# EAGLE design T01_post_final_386_revise (EAGLE 7.1.0)
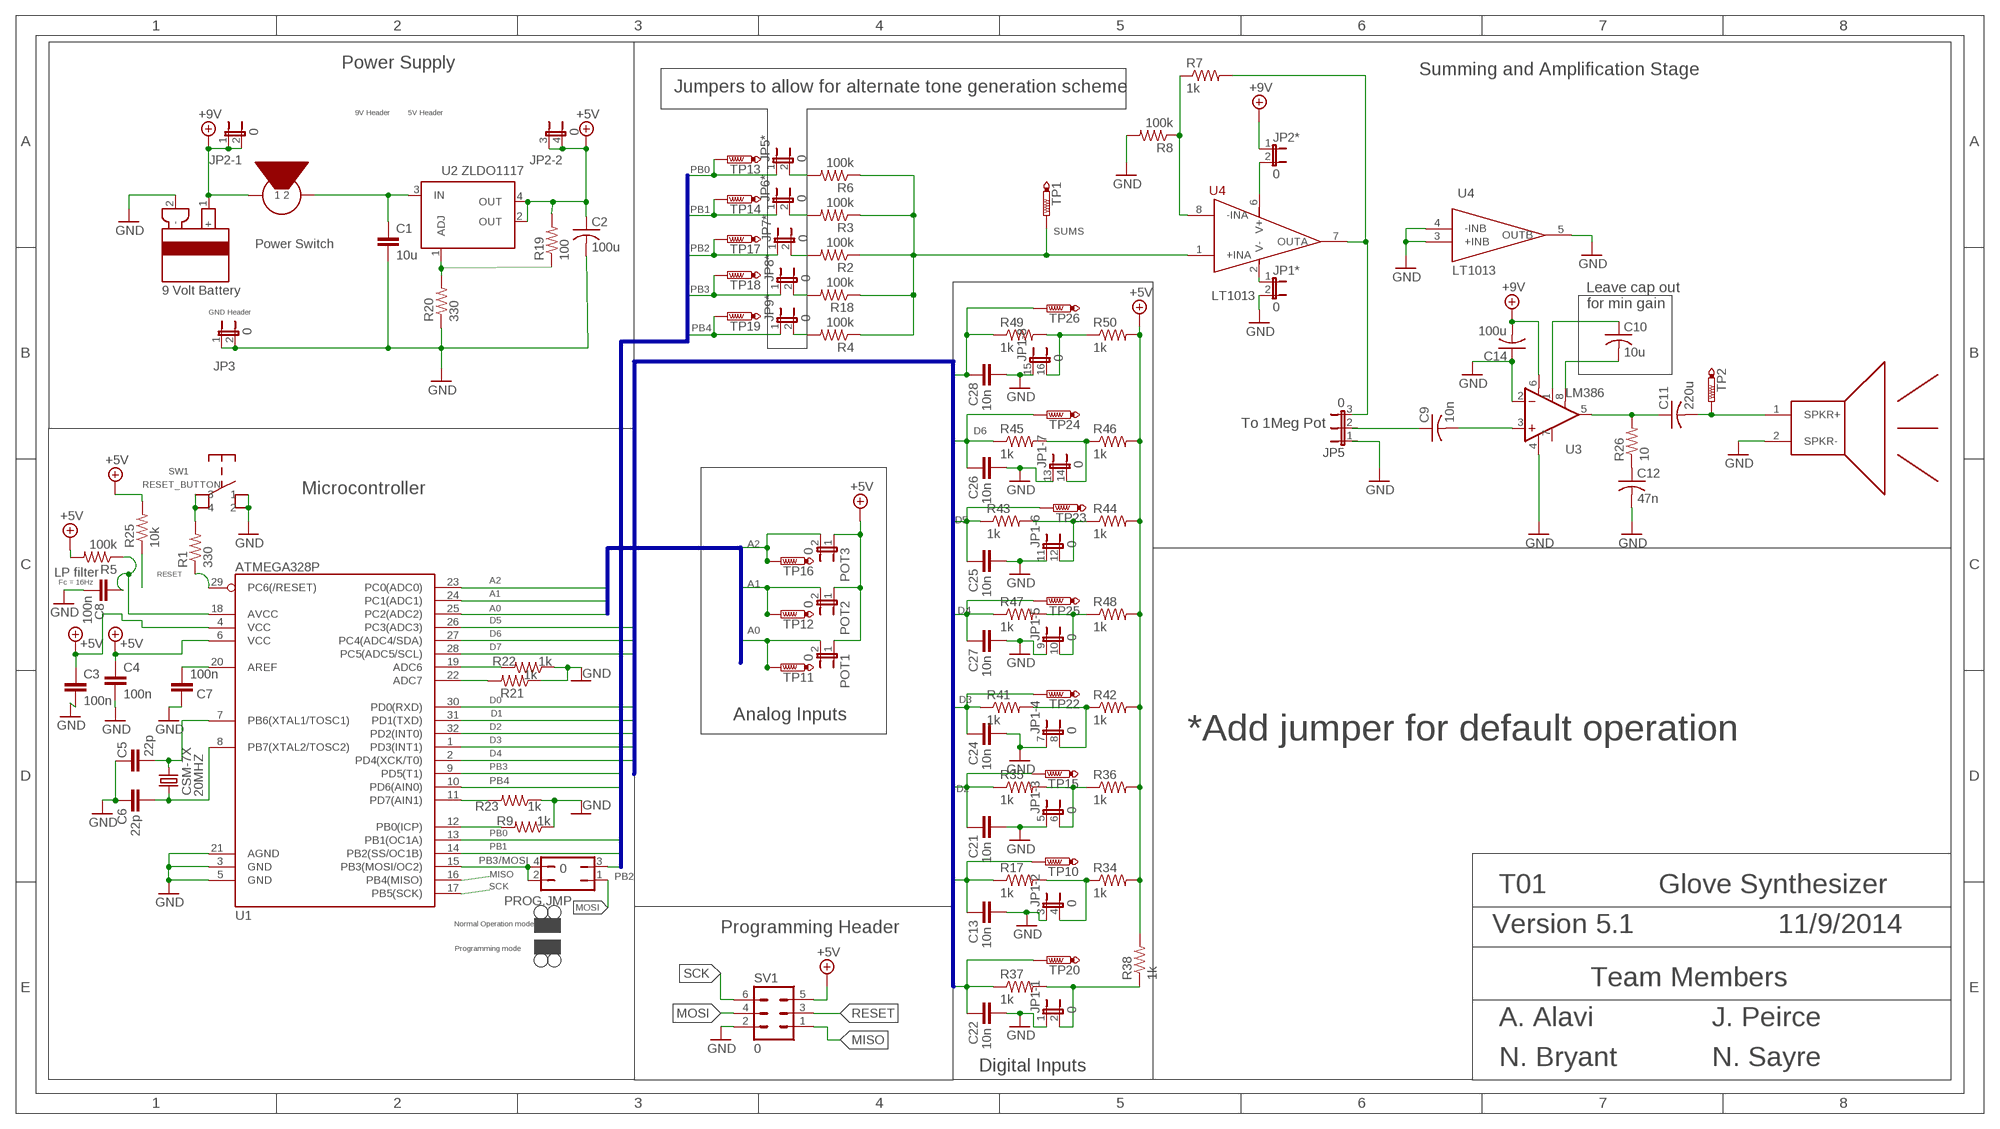
[diagram p0: schematic, sheet 1]

## Parts
20MHZ  CSM-7X  CSM-7X-DU  [CSM-7X-DU]
C1  10u  CAP0603-CAP  [0603-CAP]
C2  100u  C-US075-042X103  [C075-042X103]
C3  100n  CAP0603-CAP  [0603-CAP]
C4  100n  CAP0603-CAP  [0603-CAP]
C5  22p  CAP0603-CAP  [0603-CAP]
C6  22p  CAP0603-CAP  [0603-CAP]
C7  100n  CAP0603-CAP  [0603-CAP]
C8  100n  CAP0603-CAP  [0603-CAP]
C9  10n  C-US025-030X050  [C025-030X050]
C10  10u  C-US025-030X050  [C025-030X050]
C11  220u  C-US025-030X050  [C025-030X050]
C12  47n  C-US025-030X050  [C025-030X050]
C13  10n  CAP0603-CAP  [0603-CAP]
C14  100u  C-US025-030X050  [C025-030X050]
C21  10n  CAP0603-CAP  [0603-CAP]
C22  10n  CAP0603-CAP  [0603-CAP]
C24  10n  CAP0603-CAP  [0603-CAP]
C25  10n  CAP0603-CAP  [0603-CAP]
C26  10n  CAP0603-CAP  [0603-CAP]
C27  10n  CAP0603-CAP  [0603-CAP]
C28  10n  CAP0603-CAP  [0603-CAP]
JP1  0  JP8QE  [JP8Q]
JP1*  0  JP1E  [JP1]
JP2  0  JP2QE  [JP2Q]
JP2*  0  JP1E  [JP1]
JP3  0  JP1E  [JP1]
JP5  0  JP2E  [JP2]
JP5*  0  JP1E  [JP1]
JP6*  0  JP1E  [JP1]
JP7*  0  JP1E  [JP1]
JP8*  0  JP1E  [JP1]
JP9*  0  JP1E  [JP1]
POT1  0  JP1E  [JP1]
POT2  0  JP1E  [JP1]
POT3  0  JP1E  [JP1]
PROG.JMP  0  JP2Q  [JP2Q]
R1  330  RESISTOR0603  [0603-RES]
R2  100k  RESISTOR0603  [0603-RES]
R3  100k  RESISTOR0603  [0603-RES]
R4  100k  RESISTOR0603  [0603-RES]
R5  100k  RESISTOR0603  [0603-RES]
R6  100k  RESISTOR0603  [0603-RES]
R7  1k  RESISTOR0603  [0603-RES]
R8  100k  RESISTOR0603  [0603-RES]
R9  1k  RESISTOR0603  [0603-RES]
R17  1k  RESISTOR0603  [0603-RES]
R18  100k  RESISTOR0603  [0603-RES]
R19  100  RESISTOR0603  [0603-RES]
R20  330  RESISTOR0603  [0603-RES]
R21  1k  RESISTOR0603  [0603-RES]
R22  1k  RESISTOR0603  [0603-RES]
R23  1k  RESISTOR0603  [0603-RES]
R25  10k  RESISTOR0603  [0603-RES]
R26  10  R-US_0204/2V  [0204V]
R34  1k  RESISTOR0603  [0603-RES]
R35  1k  RESISTOR0603  [0603-RES]
R36  1k  RESISTOR0603  [0603-RES]
R37  1k  RESISTOR0603  [0603-RES]
R38  1k  RESISTOR0603  [0603-RES]
R41  1k  RESISTOR0603  [0603-RES]
R42  1k  RESISTOR0603  [0603-RES]
R43  1k  RESISTOR0603  [0603-RES]
R44  1k  RESISTOR0603  [0603-RES]
R45  1k  RESISTOR0603  [0603-RES]
R46  1k  RESISTOR0603  [0603-RES]
R47  1k  RESISTOR0603  [0603-RES]
R48  1k  RESISTOR0603  [0603-RES]
R49  1k  RESISTOR0603  [0603-RES]
R50  1k  RESISTOR0603  [0603-RES]
SV1  0  MA03-2  [MA03-2]
SW1  RESET_BUTTON  [RESET_BUTTON]
TP1  PTR1B2,54  [B2,54]
TP2  PTR1B2,54  [B2,54]
TP10  PTR1B2,54  [B2,54]
TP11  PTR1B2,54  [B2,54]
TP12  PTR1B2,54  [B2,54]
TP13  PTR1B2,54  [B2,54]
TP14  PTR1B2,54  [B2,54]
TP15  PTR1B2,54  [B2,54]
TP16  PTR1B2,54  [B2,54]
TP17  PTR1B2,54  [B2,54]
TP18  PTR1B2,54  [B2,54]
TP19  PTR1B2,54  [B2,54]
TP20  PTR1B2,54  [B2,54]
TP22  PTR1B2,54  [B2,54]
TP23  PTR1B2,54  [B2,54]
TP24  PTR1B2,54  [B2,54]
TP25  PTR1B2,54  [B2,54]
TP26  PTR1B2,54  [B2,54]
U1  ATMEGA328P  ATMEGA328_SMT  [TQFP32-08]
U2  ZLDO1117  [SOT223]
U3  LM386  [DIP08]
U4  LT1013  [SO08]
U$1  SPEAKER  [JP1]
U$7  POWER_SWITCH  [JP1]
U$8  9VOLTBATTERY  [JP1]

## Nets
+5V: C2.1 C3.1 C4.1 JP2.3 JP2.4 POT1.1 POT2.1 POT3.1 R5.2 R19.2 R25.2 R34.2 R36.2 R38.2 R42.2 R44.2 R46.2 R48.2 R50.2 SV1.5 U1.4(VCC) U1.6(VCC) U2.2(OUT) U2.4(OUT)
+9V: C14.2 JP2*.1 JP2.1 JP2.2 U3.6(V+) U$7.1 U$8.1(+)
A0: POT1.2 TP11.TP U1.25(PC2(ADC2))
A1: POT2.2 TP12.TP U1.24(PC1(ADC1))
A2: POT3.2 TP16.TP U1.23(PC0(ADC0))
D0: C22.2 R37.1 TP20.TP U1.30(PD0(RXD))
D1: C13.2 R17.1 TP10.TP U1.31(PD1(TXD))
D2: C21.2 R35.1 TP15.TP U1.32(PD2(INT0))
D3: C24.2 R41.1 TP22.TP U1.1(PD3(INT1))
D4: C27.2 R47.1 TP25.TP U1.2(PD4(XCK/T0))
D5: C25.2 R43.1 TP23.TP U1.26(PC3(ADC3))
D6: C26.2 R45.1 TP24.TP U1.27(PC4(ADC4/SDA))
D7: C28.2 R49.1 TP26.TP U1.28(PC5(ADC5/SCL))
GND: C1.2 C2.2 C3.2 C4.2 C5.2 C6.2 C7.2 C8.2 C12.2 C13.1 C14.1 C21.1 C22.1 C24.1 C25.1 C26.1 C27.1 C28.1 JP1*.2 JP1.1 JP1.3 JP1.5 JP1.7 JP1.9 JP1.11 JP1.13 JP1.15 JP3.1 JP3.2 R8.2 R9.1 R20.1 R21.1 R22.1 R23.1 SV1.2 SW1.1 SW1.2 U1.3(GND) U1.5(GND) U1.21(AGND) U3.2(-IN) U3.4(V-) U4.3(+INB) U4.4(-INB) U4.5(OUTB) U$1.2(SPKR-) U$8.2(-)
MISO: SV1.1 U1.16(PB4(MISO))
MOSI: PROG.JMP.1 SV1.4
N$1: C7.1 U1.20(AREF)
N$2: JP1.8 R41.2 R42.1
N$3: JP1.12 R43.2 R44.1
N$4: R1.1 U1.29(PC6(/RESET))
N$5: R7.2 U4.7(OUTA)
N$6: 20MHZ.1 C5.1 U1.7(PB6(XTAL1/TOSC1))
N$7: 20MHZ.2 C6.1 U1.8(PB7(XTAL2/TOSC2))
N$8: C8.1 R5.1 U1.18(AVCC)
N$9: R21.2 U1.22(ADC7)
N$10: R22.2 U1.19(ADC6)
N$11: C9.1
N$12: C9.2 U3.3(+IN)
N$13: JP1.6 R35.2 R36.1
N$16: R7.1 R8.1 U4.8(-INA)
N$17: R9.2 U1.12(PB0(ICP))
N$18: JP5*.2 R6.2
N$21: JP9*.2 R4.2
N$22: R1.2 SW1.3 SW1.4
N$23: JP1.4 R17.2 R34.1
N$25: JP8*.2 R18.2
N$27: C10.1 U3.1(GAIN)
N$31: C11.2 TP2.TP U$1.1(SPKR+)
N$32: JP7*.2 R2.2
N$34: JP2*.2 U4.6(V+)
N$37: R19.1 R20.2 U2.1(ADJ)
N$38: C1.1 U2.3(IN) U$7.2
N$39: JP6*.2 R3.2
N$41: C10.2 U3.8(GAIN)
N$43: JP1.2 R37.2 R38.1
N$49: C11.1 R26.2 U3.5(OUT)
N$50: C12.1 R26.1
N$51: JP1.14 R45.2 R46.1
N$52: JP1.10 R47.2 R48.1
N$53: JP1.16 R49.2 R50.1
PB0: JP5*.1 TP13.TP U1.13(PB1(OC1A))
PB1: JP6*.1 TP14.TP U1.14(PB2(SS/OC1B))
PB2: JP7*.1 PROG.JMP.3 TP17.TP
PB3: JP8*.1 TP18.TP U1.9(PD5(T1))
PB3/MOSI: PROG.JMP.2 PROG.JMP.4 U1.15(PB3(MOSI/OC2))
PB4: JP9*.1 TP19.TP U1.10(PD6(AIN0))
PD7: R23.2 U1.11(PD7(AIN1))
RESET: R25.1 SV1.3
SCK: SV1.6 U1.17(PB5(SCK))
SUMS: R2.1 R3.1 R4.1 R6.1 R18.1 TP1.TP U4.1(+INA)
V-: JP1*.1 U4.2(V-)
Unconnected: JP5.1 JP5.2 JP5.3 U3.7(BP)

## Buses
D[0..7]
PB[0..4]
A[0..2]

## Notes on the sheet
- Power Supply
- Summing and Amplification Stage
- Jumpers to allow for alternate tone generation scheme
- 9V Header | 5V Header
- Power Switch
- Leave cap out
  for min gain
- GND Header
- To 1Meg Pot
- Microcontroller
- LP filter
- Fc = 16Hz
- Analog Inputs
- *Add jumper for default operation
- T01 | Glove Synthesizer
- Normal Operation mode
- Programming Header | Version 5.1 | 11/9/2014
- Programming mode
- Team Members
- A. Alavi | J. Peirce
- Digital Inputs
- N. Bryant | N. Sayre

## Library data of the parts
20MHZ = crystal:CSM-7X-DU: SMD CRYSTAL Source: www.ecsxtal.com .. Crystal 3.6864MHz CSM_7X_DU.PDF; OC_FARNELL: unknown; OC_NEWARK: unknown
C1 C3-C8 C13 C21 C22 C24-C28 = SparkFun-Capacitors:CAP: Capacitor Standard 0603 ceramic capacitor, and 0.1" leaded capacitor.
C2 C9-C12 C14 = adafruit:C-US: CAPACITOR, American symbol
JP1 = jumper:JP8QE: JUMPER
JP1* JP2* JP3 JP5* JP6* JP7* JP8* JP9* POT1-POT3 = jumper:JP1E: JUMPER
JP2 = jumper:JP2QE: JUMPER
JP5 = jumper:JP2E: JUMPER
PROG.JMP = jumper:JP2Q: JUMPER
R1-R9 R17-R23 R25 R34-R38 R41-R50 = SparkFun-Resistors:RESISTOR: Resistor Basic schematic elements and footprints for 0603, 1206, and PTH resistors.
R26 = adafruit:R-US_: RESISTOR, American symbol
SV1 = con-lstb:MA03-2: PIN HEADER; OC_FARNELL: unknown; OC_NEWARK: unknown
SW1 = Synth_Glove:RESET_BUTTON
TP1 TP2 TP10-TP20 TP22-TP26 = testpad:PTR1: TEST PIN
U1 = SparkFun-DigitalIC:ATMEGA328_SMT: 32-Pin Atmega328 part Commonly used on Arduino compatible boards Available in QFP and QFN packages TQFP is IC-09069 QFN is non-stock; PROD_ID: IC-09069
U2 = Synth_Glove:ZLDO1117
U3 = SparkFun-AnalogIC:LM386: low voltage audio power amplifier
U4 = Synth_Glove:LT1013: Linear Technology dual input precision op amps
U$1 = Synth_Glove:SPEAKER
U$7 = Synth_Glove:POWER_SWITCH
U$8 = Synth_Glove:9VOLTBATTERY

## Board
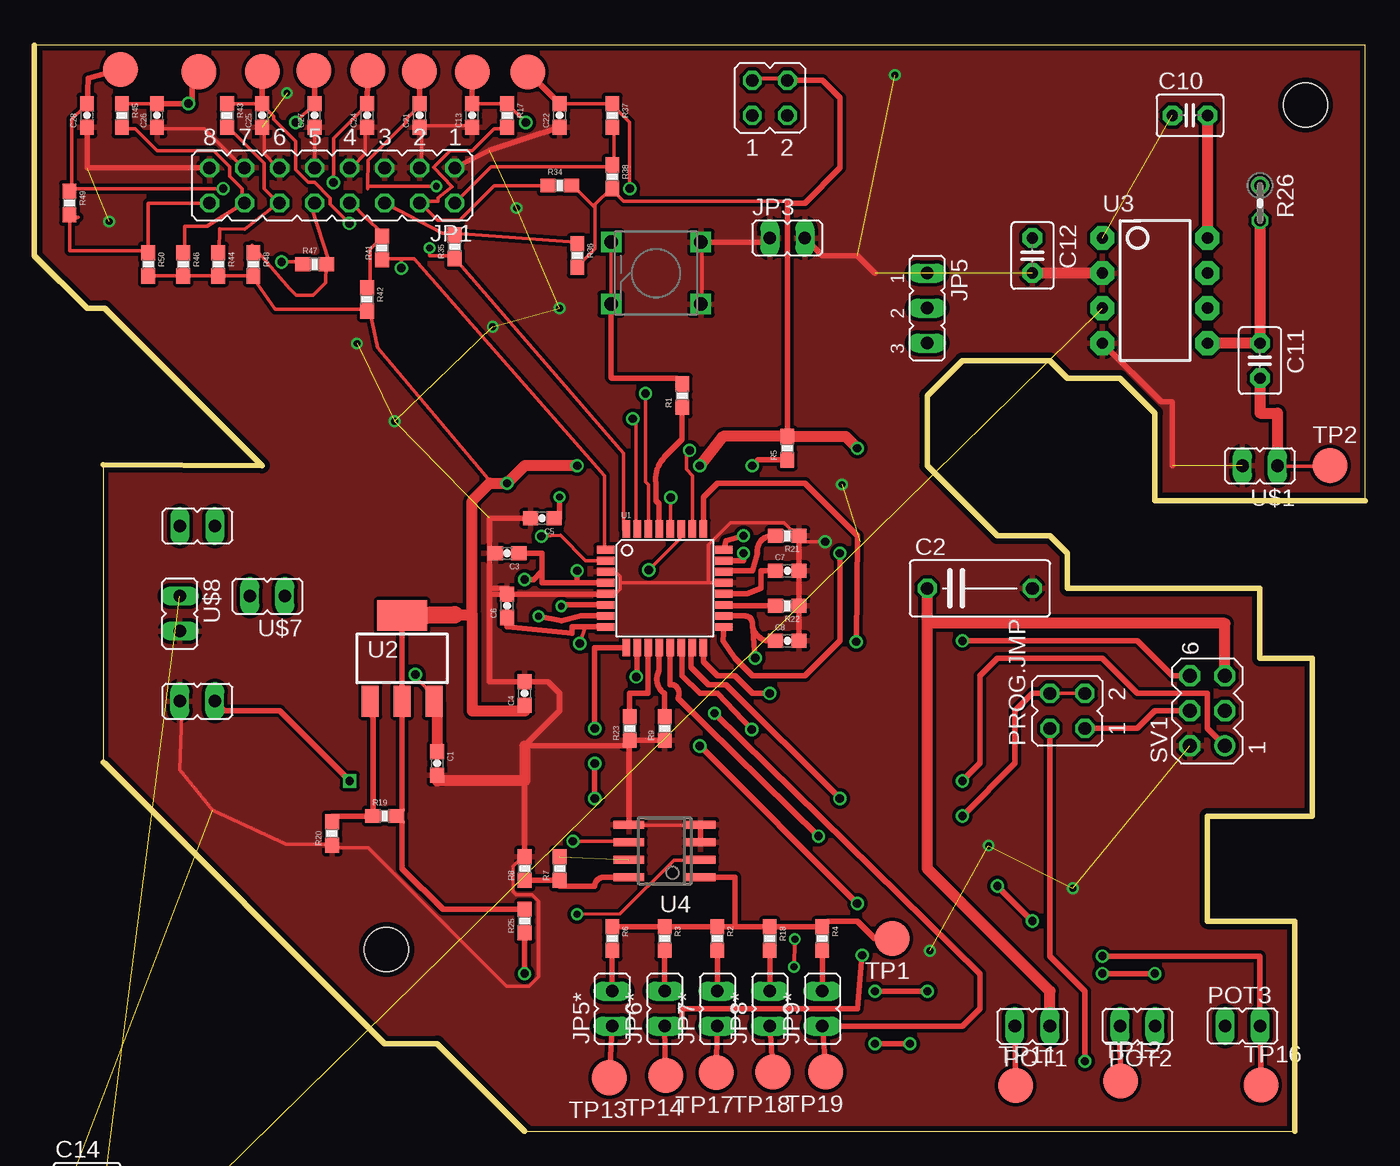
[diagram p1: board, top side]
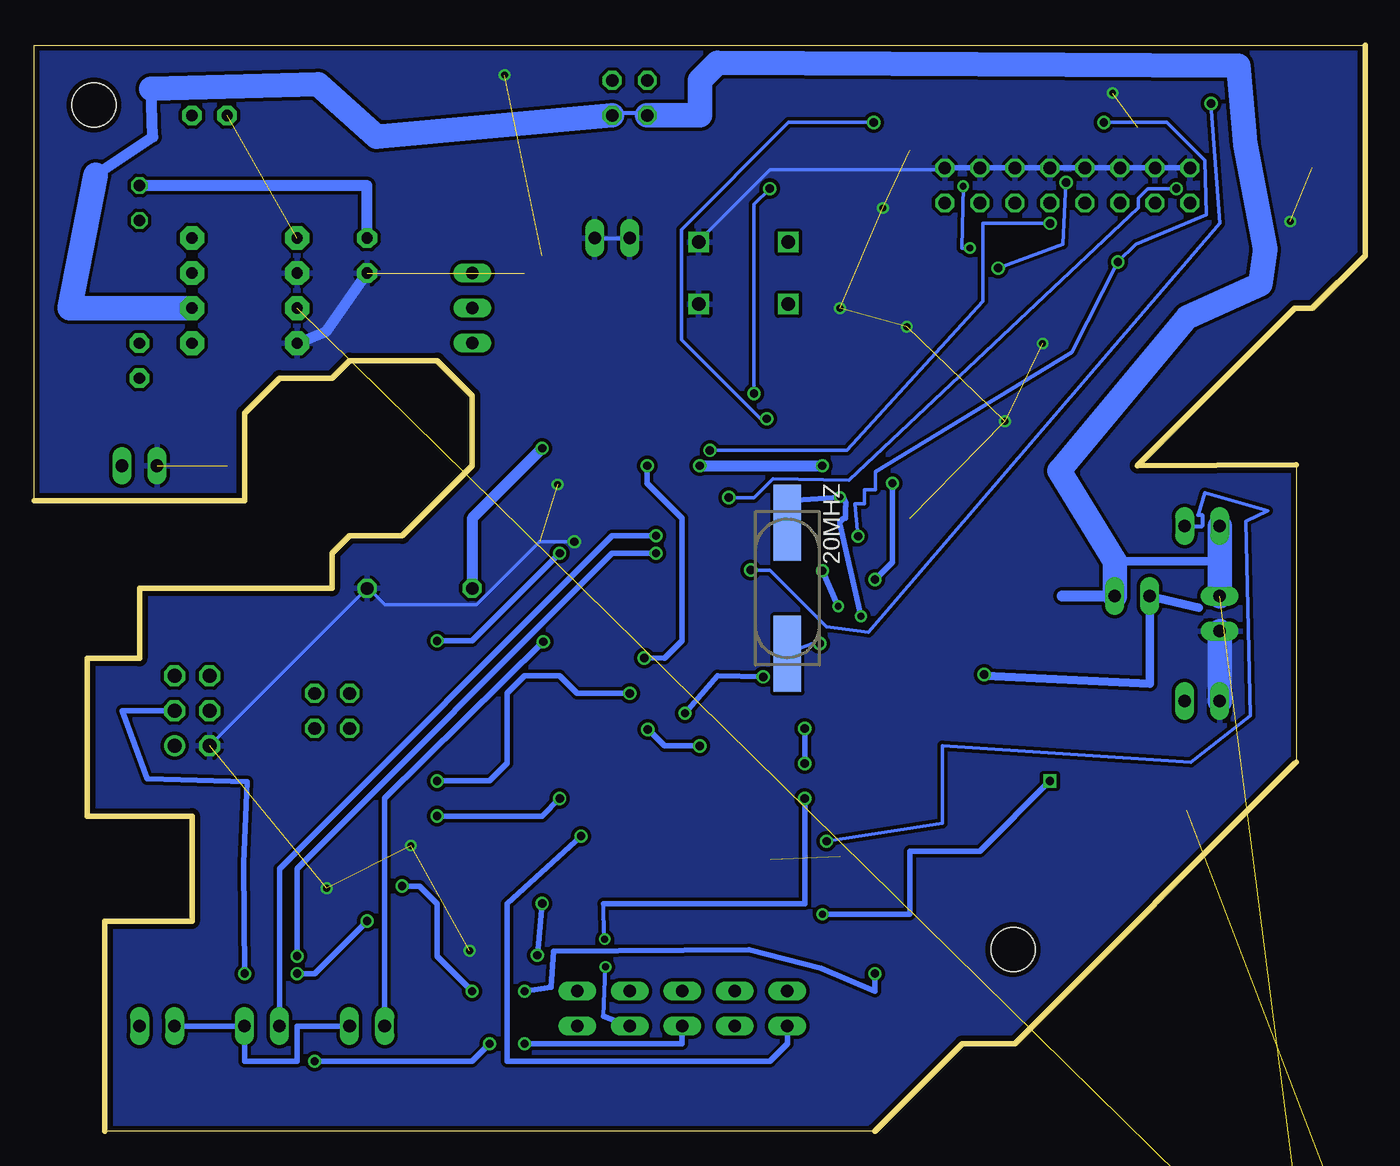
[diagram p2: board, bottom side, seen from below]

Size 96.52 x 78.74 mm. Coordinates in mm from the lower left corner, seen from the top.
Outline: 35.56,0 91.44,0 91.44,15.24 85.09,15.24 85.09,22.86 92.71,22.86 92.71,34.29 88.9,34.29 88.9,39.37 74.93,39.37 74.93,41.91 73.66,43.18 69.85,43.18 64.77,48.26 64.77,53.34 67.31,55.88 73.66,55.88 74.93,54.61 78.74,54.61 81.28,52.07 81.28,45.72 88.9,45.72 96.52,45.72 96.52,78.74 0,78.74 0,63.5 3.81,59.69 5.08,59.69 16.51,48.26 4.97,48.33 4.97,26.74 5.08,26.67 25.4,6.35 29.21,6.35 35.56,0
Copper layers (1*16): Top 0.0356mm / dielectric 1.5011mm / Bottom 0.0356mm
Design rules "OSH-Park-2-layer": minimum track width 6mil, minimum drill 13mil, track to track 6mil, track to pad 6mil, pad to pad 6mil, via to via 6mil, smd to smd 6mil, copper to edge 15mil, drill to drill 6mil, minimum pad ring 7mil, minimum via ring 7mil, stop-mask expansion 3mil, vias tented up to drill 0mil, thermal gap 10mil
Holes 3.2 mm at 25.54,13.17 92.2,74.42

### Footprints (pad centres in the part's own frame; a part is rotated, then mirrored left to right if it is on the bottom)
CSM-7X-DU = smd 5.5 x 2: 1 -4.75,0; 2 4.75,0
0603-CAP = smd 1.1 x 1: 1 -0.85,0; 2 0.85,0
C075-042X103 = drill 0.914 octagon: 1 -3.81,0; 2 3.81,0
C025-030X050 = drill 0.813 pad 1.422 octagon: 1 -1.27,0; 2 1.27,0
JP8Q = drill 0.914 octagon: 1 -8.89,-1.27; 2 -8.89,1.27; 3 -6.35,-1.27; 4 -6.35,1.27; 5 -3.81,-1.27; 6 -3.81,1.27; 7 -1.27,-1.27; 8 -1.27,1.27; 9 1.27,-1.27; 10 1.27,1.27; 11 3.81,-1.27; 12 3.81,1.27; 13 6.35,-1.27; 14 6.35,1.27; 15 8.89,-1.27; 16 8.89,1.27
JP1 = drill 0.914 long: 1 0,-1.27; 2 0,1.27
JP2Q = drill 0.914 octagon: 1 -1.27,-1.27; 2 1.27,-1.27; 3 -1.27,1.27; 4 1.27,1.27
JP2 = drill 0.914 long: 1 -2.54,0; 2 0,0; 3 2.54,0
0603-RES = smd 1.1 x 1: 1 -0.85,0; 2 0.85,0
0204V = drill 0.813 octagon: 1 -1.27,0; 2 1.27,0
MA03-2 = drill 1.016: 1 -2.54,-1.27 | drill 1.016 octagon: 2 -2.54,1.27; 3 0,-1.27; 4 0,1.27; 5 2.54,-1.27; 6 2.54,1.27
RESET_BUTTON = drill 0.991 square: 1 3.251,2.248; 2 3.251,-2.248; 3 -3.251,2.248; 4 -3.251,-2.248
B2,54 = smd 2.54 x 2.54: TP 0,0
TQFP32-08 = smd 1.27 x 0.559: 1 -4.293,2.8; 2 -4.293,2; 3 -4.293,1.2; 4 -4.293,0.4; 5 -4.293,-0.4; 6 -4.293,-1.2; 7 -4.293,-2; 8 -4.293,-2.8; 17 4.293,-2.8; 18 4.293,-2; 19 4.293,-1.2; 20 4.293,-0.4; 21 4.293,0.4; 22 4.293,1.2; 23 4.293,2; 24 4.293,2.8 | smd 0.559 x 1.27: 9 -2.8,-4.293; 10 -2,-4.293; 11 -1.2,-4.293; 12 -0.4,-4.293; 13 0.4,-4.293; 14 1.2,-4.293; 15 2,-4.293; 16 2.8,-4.293; 25 2.8,4.293; 26 2,4.293; 27 1.2,4.293; 28 0.4,4.293; 29 -0.4,4.293; 30 -1.2,4.293; 31 -2,4.293; 32 -2.8,4.293
SOT223 = smd 1.219 x 2.235: 1 -2.311,-3.099; 2 0,-3.099; 3 2.311,-3.099 | smd 3.6 x 2.2: 4 0,3.099
DIP08 = drill 0.813 pad 1.727 octagon: 1 -3.81,-3.81; 2 -1.27,-3.81; 3 1.27,-3.81; 4 3.81,-3.81; 5 3.81,3.81; 6 1.27,3.81; 7 -1.27,3.81; 8 -3.81,3.81
SO08 = smd 0.6 x 2.2: 1 -1.905,-2.6; 2 -0.635,-2.6; 3 0.635,-2.6; 4 1.905,-2.6; 5 1.905,2.6; 6 0.635,2.6; 7 -0.635,2.6; 8 -1.905,2.6

### Placement (x,y rotation side)
20MHZ  41.91,39.37 270 bottom
C1  29.21,26.67 270 top
C2  68.58,39.37 0 top
C3  34.29,41.91 180 top
C4  35.56,31.75 90 top
C5  36.83,44.45 180 top
C6  34.29,38.1 90 top
C7  54.61,40.64 0 top
C8  54.61,35.56 0 top
C9  3.81,-11.43 0 top  (outside the outline)
C10  83.82,73.66 0 top
C11  88.9,55.88 270 top
C12  72.39,63.5 270 top
C13  31.75,73.66 90 top
C14  3.81,-3.81 0 top  (outside the outline)
C21  27.94,73.66 90 top
C22  38.1,73.66 90 top
C24  24.13,73.66 90 top
C25  16.51,73.66 90 top
C26  8.89,73.66 90 top
C27  20.32,73.66 90 top
C28  3.81,73.66 90 top
JP1  21.59,68.58 180 top
JP1*  11.82,31.19 90 top
JP2  53.34,74.93 0 top
JP2*  11.82,43.89 270 top
JP3  54.61,64.77 270 top
JP5  64.77,59.69 270 top
JP5*  41.91,8.89 0 top
JP6*  45.72,8.89 0 top
JP7*  49.53,8.89 0 top
JP8*  53.34,8.89 0 top
JP9*  57.15,8.89 0 top
POT1  72.39,7.62 90 top
POT2  80.01,7.62 90 top
POT3  87.63,7.62 270 top
PROG.JMP  74.93,30.48 90 top
R1  46.99,53.34 90 top
R2  49.53,13.97 270 top
R3  45.72,13.97 270 top
R4  57.15,13.97 270 top
R5  54.61,49.53 90 top
R6  41.91,13.97 270 top
R7  38.1,19.05 90 top
R8  35.56,19.05 90 top
R9  45.72,29.21 90 top
R17  34.29,73.66 270 top
R18  53.34,13.97 270 top
R19  25.4,22.86 0 top
R20  21.59,21.59 90 top
R21  54.61,43.18 180 top
R22  54.61,38.1 180 top
R23  43.18,29.21 90 top
R25  35.56,15.24 90 top
R26  88.9,67.31 270 top
R34  38.1,68.58 0 top
R35  30.48,64.14 90 top
R36  39.37,63.5 270 top
R37  41.91,73.66 270 top
R38  41.91,69.22 270 top
R41  25.22,64.05 90 top
R42  24.13,60.33 270 top
R43  13.97,73.66 270 top
R44  13.34,62.87 270 top
R45  6.35,73.66 270 top
R46  10.8,62.87 270 top
R47  20.32,62.87 0 top
R48  15.88,62.87 270 top
R49  2.54,67.31 270 top
R50  8.25,62.87 270 top
SV1  85.09,30.48 90 top
SW1  45.09,62.23 0 top
TP1  62.23,13.97 180 top
TP2  93.98,48.26 0 top
TP10  31.75,76.8 0 top
TP11  71.19,3.31 0 top
TP12  78.77,3.66 0 top
TP13  41.71,3.88 180 top
TP14  45.78,4.05 180 top
TP15  27.92,76.86 0 top
TP16  88.98,3.34 0 top
TP17  49.44,4.26 180 top
TP18  53.57,4.29 180 top
TP19  57.41,4.31 180 top
TP20  35.8,76.8 0 top
TP22  24.19,76.92 0 top
TP23  16.53,76.84 0 top
TP24  11.94,76.83 0 top
TP25  20.28,76.92 0 top
TP26  6.25,76.99 0 top
U1  45.72,39.37 0 top
U2  26.67,34.29 0 top
U3  81.28,60.96 270 top
U4  45.72,20.32 90 top
U$1  88.9,48.26 90 top
U$7  16.9,38.81 90 top
U$8  10.55,37.54 180 top

### Tracks (layer width: path | path; a pad name or v marks a point on that pad's centre or on a via)
+5V  (via drill 0.5, 0.6)
  Top 0.254: R50.2 8.38,62.03 10.67,62.03 R46.2 10.9,62.03 13.18,62.03 R44.2 13.41,62.03 15.7,62.03 R48.2 15.93,61.8 17.48,59.61 24.11,59.61 R42.2 24.33,59.38 24.89,56.8 32.89,47.32 33.02,46.99 | 40.66,66.98 40.66,67.21 41.81,68.35 R38.2 42.04,68.35 42.04,68.12 42.72,67.44 54.61,67.44 54.61,67.31 | 40.66,66.98 40.66,64.01 39.52,62.87 R36.2 | 40.66,66.98 39.06,68.58 R34.2 | U2.2 26.72,31.32 26.67,31.32
  Top 0.305: JP2.4 54.61,76.35 52.09,76.35 52.09,76.2 JP2.3
  Top 0.406: U2.4 26.67,31.32 U2.2 26.67,23.28 R19.2 26.67,22.44 26.67,19.05 29.63,16.09 R25.2 | C3.1 36.83,41.91 36.83,40.64 | 36.83,40.64 36.83,39.77 39.37,39.77 | U1.4 39.37,39.77 | U1.6 38.27,38.17 38.27,38.07 v38.22,38.06 | v39.37,40.64 39.37,39.77 | R5.2 54.61,67.31 55.88,67.31 58.42,69.85 58.42,74.93 57.15,76.2 JP2.4 | v35.56,40.01 36.2,40.01 36.83,40.64
  Top 0.813: POT1.1 73.66,10.16 64.77,19.05 64.77,36.83 | 64.77,36.83 C2.1 | 30.48,37.47 31.75,37.47 | 31.75,37.47 31.75,30.48 35.56,30.48 C4.1 | v59.69,49.53 58.84,50.38 R5.2 49.95,50.38 v48.26,48.26 | v39.37,48.26 35.56,48.26 v34.29,46.99 33.02,46.99 31.75,45.72 31.75,37.47 | SV1.5 86.36,36.83 64.77,36.83
  Top 1.27: U2.4 30.48,37.47
  Bottom 0.406: POT3.1 POT2.1 81.28,5.08 77.47,5.08 77.47,7.62 POT1.1 | v38.22,38.06 v39.37,40.64 | v34.29,46.99 34.29,41.27 v35.56,40.01
  Bottom 0.813: v59.69,49.53 64.77,44.45 C2.1 | v48.26,48.26 v39.37,48.26
+9V  (1 unrouted)
  Bottom 0.254: 52.78,73.84 JP2.1 | 53.92,73.84 JP2.2
  Bottom 0.305: 53.92,73.84 52.07,73.84 JP2.1
  Bottom 0.61: 10.55,41.35 18.17,41.35
  Bottom 0.813: U$7.1 21.98,38.81 | 92.06,69.37 87.93,72.11 88.06,75.6
  Bottom 1.778: U$8.1 10.55,41.35 JP2*.1 | U$7.1 18.17,41.35 22.17,47.9 12.89,59.02 7.59,61.41 7.24,63.96 8.68,71.56 9.18,77.27 46.99,77.47 48.26,76.2 48.26,73.66 JP2.1 | JP2.2 71.68,72.11 75.95,75.92 88.06,75.6 | 92.06,69.37 93.98,59.69 U3.6
A0  (via drill 0.6)
  Top 0.406: TP11.TP POT1.2 | v59.61,35.5 59.69,43.18 55.88,46.99 49.53,46.99 48.52,45.98 U1.25
  Bottom 0.406: POT1.2 71.12,24.13 v59.61,35.5
A1  (via drill 0.6)
  Top 0.406: U1.24 50.16,42.8 v51.44,43.18 | TP12.TP POT2.2
  Bottom 0.406: v51.44,43.18 54.61,43.18 78.74,19.05 POT2.2
A2  (via drill 0.6)
  Top 0.406: U1.23 51.44,41.37 v51.44,41.91 | v77.47,12.7 88.9,12.7 POT3.2 88.97,5.44 TP16.TP
  Bottom 0.406: v51.44,41.91 54.61,41.91 77.47,19.05 v77.47,12.7
D0  (via drill 0.61)
  Top 0.254: C22.2 38.15,74.52 41.81,74.52 R37.1 42.04,74.3 43.18,73.15 v43.18,68.35 | v44.32,53.49 44.32,47.09 44.55,46.86 44.55,43.66 U1.30
  Top 0.406: TP20.TP C22.2
  Bottom 0.254: v44.32,53.49 44.32,67.21 v43.18,68.35
D1  (via drill 0.61)
  Top 0.254: 31.75,74.52 34.27,74.52 R17.1 34.49,74.3 v35.64,73.15 | v43.41,51.66 43.64,51.44 43.64,43.66 U1.31
  Top 0.406: TP10.TP 31.75,74.52 C13.2
  Bottom 0.254: v43.41,51.66 43.87,51.66 49.58,57.38 49.58,65.38 41.81,73.15 v35.64,73.15
D2  (via drill 0.5)
  Top 0.254: 24.17,68.61 24.21,70.41 26.95,73.15 26.95,73.38 27.86,74.3 C21.2 | 24.17,68.61 24.16,68.35 | U1.32 42.72,43.66 42.72,49.15 30.51,63.27 R35.1 30.28,63.5 28.66,63.5 v28.66,64.05 | v29.15,68.53 24.17,68.52 24.17,68.61
  Top 0.406: TP15.TP C21.2
  Bottom 0.254: v28.66,64.05 29.23,64.05 v29.15,68.53
D3  (via drill 0.61)
  Top 0.254: 24.13,74.93 24.21,74.75 24.21,74.52 C24.2 23.98,74.3 21.69,72.01 v21.69,68.81 | 26.62,63.27 27.53,63.27 41.35,47.55 41.35,42.29 U1.1 | 26.62,63.27 25.48,63.27 R41.1 | 26.62,63.27 v26.62,62.59
  Top 0.406: TP22.TP 24.13,74.93
  Bottom 0.254: v21.69,68.81 21.93,64.33 v26.62,62.59
D4  (via drill 0.61)
  Top 0.254: v17.93,63.04 19.3,63.04 R47.1 | 20.32,74.52 v18.95,73.15 | v36.78,43.15 38.15,43.2 39.98,41.38 41.35,41.38 U1.2
  Top 0.406: TP25.TP 20.32,74.52 C27.2
  Bottom 0.254: v18.95,73.15 14.38,73.15 11.63,70.41 11.52,66.46 16.61,64.31 v17.93,63.04 21.28,56.47 35.52,47.81 35.52,46.51 36.33,46.51 36.33,45.49 37.01,45.49 v36.78,43.15
D5  (via drill 0.61)
  Top 0.254: R43.1 14.15,74.52 16.43,74.52 C25.2 16.66,74.3 17.35,73.61 17.35,73.38 18.95,71.78 18.95,69.72 19.86,68.81 20.32,68.81 21.46,67.67 21.46,67.21 v22.84,65.84 | v47.52,49.38 47.3,49.15 47.3,48.01 47.75,47.55 47.75,43.66 U1.26
  Top 0.406: TP23.TP C25.2
  Bottom 0.254: v47.52,49.38 37.56,49.38 27.73,60.19 27.73,65.84 v22.84,65.84
D6  (via drill 0.61)
  Top 0.254: R45.1 6.37,74.52 8.89,74.52 C26.2 | v44.55,40.69 46.84,42.98 46.84,43.66 U1.27 | v11.18,74.52 v11.18,74.51
  Top 0.406: TP24.TP 11.43,76.2 11.43,74.51 v11.18,74.51 C26.2
  Bottom 0.254: v44.55,40.69 43.18,40.69 39.06,36.58 36.03,36.18 10.55,65.84 v11.18,74.52
D7  (via drill 0.61)
  Top 0.254: 2.72,68.35 2.72,73.38 3.63,74.3 C28.2 | v46.15,45.95 46.15,43.66 U1.28 | 2.72,68.35 v13.69,68.35 | 2.72,68.35 R49.1
  Top 0.406: TP26.TP 3.89,76.35 C28.2
  Bottom 0.254: v46.15,45.95 44.32,45.95 42.95,47.32 37.44,47.2 16.43,66.98 16.43,67.67 15.75,68.35 v13.69,68.35
GND  (via drill 0.5, 0.61)  (16 unrouted)
  Top 0.254: JP1*.2 10.72,31.21 10.52,26.22 12.94,23.29 18.26,20.8 21.46,20.8 R20.1 21.69,20.57 24.21,20.57 34.27,10.52 35.87,10.52 36.55,11.2 36.55,16.69 36.09,17.14 34.95,17.14 34.72,17.37 34.72,19.2 35.41,19.89 R8.2 | 42.49,39.78 42.49,39.32 42.27,39.09 41.58,39.09 U1.5 | 42.49,39.78 42.49,40.23 42.27,40.46 41.58,40.46 U1.3 | 42.49,39.78 48.9,39.78 | 48.9,39.78 49.81,39.78 U1.21 | U4.4 48.21,22.17 43.18,22.17 U4.5 | 48.9,39.78 48.9,42.52 50.49,44.12 54.38,44.12 55.3,43.2 R21.1 55.52,42.75 v57.35,42.75 | C26.1 8.89,72.69 12.32,72.69 15.06,69.95 JP1.13 | C24.1 23.98,72.69 23.98,70.87 23.06,69.95 JP1.7 | JP1.9 C27.1 | C25.1 16.66,72.69 16.66,70.87 17.58,69.95 JP1.11 | JP1.3 28.09,69.95 28.09,72.69 C21.1 28.09,72.92 31.75,72.92 C13.1 | SW1.2 48.44,60.12 48.44,64.47 SW1.1
  Top 0.406: R21.1 C7.2 R22.1 C8.2 | C6.2 41.41,38.95 U1.5 | C6.2 34.29,39.37 33.02,39.37 33.02,32.6 C4.2 37.25,32.6 38.1,31.75 38.1,30.48 35.56,27.94 42.76,27.94 arc90 R23.1 | C6.2 33.02,38.95 33.02,41.91 | C3.2 33.02,41.91 | 33.02,41.91 33.02,44.45 C5.2 | R23.1 R9.1 | R23.1 arc90 43.12,28.3 U4.5 | U4.3 U4.4 | R8.2 35.56,25.4 | SW1.1 53.05,64.48 JP3.1 | 60.96,62.23 59.69,63.5 57.15,63.5 JP3.2 | C22.1 33.02,71.12 JP1.1 | C28.1 3.81,69.85 JP1.15 | 82.55,48.26 82.55,52.82 82.48,52.89 81.73,52.89 U3.4
  Top 0.813: U3.2 C12.2 | 35.56,27.94 35.56,25.4 29.21,25.4 C1.2
  Bottom 0.254: JP1.5 25.58,69.95 25.58,69.85 | JP1.11 17.8,69.95 17.8,69.85 | 20.32,69.95 JP1.9 | JP1.7 23.06,69.95 23.06,69.85 | JP1.13 15.29,69.95 15.29,69.85 | SV1.2 C2.2 72.21,39.32 71.07,38.18 64.44,38.18 59.87,42.75 v57.35,42.75 | 53.47,64.92 JP3.1 | JP1.1 30.61,69.72 43.18,69.72 48.21,64.69 SW1.1
  Bottom 0.305: JP3.2 JP3.1
  Bottom 0.406: JP1.15 JP1.13 15.29,69.85 JP1.11 17.8,69.85 JP1.9 JP1.7 23.06,69.85 JP1.5 25.58,69.85 JP1.3 JP1.1
  Bottom 0.813: U3.4 75.33,58.02 C12.2
  Bottom 1.778: U$8.2 JP1*.2
  other vias: 38.1,59.69 26.12,51.49 64.96,13.09 69.21,20.72 62.42,76.59 23.39,57.12 5.42,65.97 33.24,58.34 34.98,66.95 18.31,75.29 58.58,46.9 75.32,17.62
  pour Bottom (isolate 0.254): 29.21,6.35 25.4,6.35 5.08,26.67 5.08,48.26 16.51,48.26 5.08,59.69 3.81,59.69 0,63.5 0,78.74 96.52,78.74 96.52,45.72 81.28,45.72 81.28,52.07 78.74,54.61 74.93,54.61 73.66,55.88 67.31,55.88 64.77,53.34 64.77,48.26 69.85,43.18 73.66,43.18 74.93,41.91 74.93,39.37 88.9,39.37 88.9,34.29 92.71,34.29 92.71,22.86 85.09,22.86 85.09,15.24 91.44,15.24 91.44,0 35.56,0
  pour Top (isolate 0.254): 35.56,0 91.44,0 91.44,15.24 85.09,15.24 85.09,22.86 92.71,22.86 92.71,34.29 88.9,34.29 88.9,39.37 74.93,39.37 74.93,41.91 73.66,43.18 69.85,43.18 64.77,48.26 64.77,53.34 67.31,55.88 73.66,55.88 74.93,54.61 78.74,54.61 81.28,52.07 81.28,45.72 96.52,45.72 96.52,78.74 0,78.74 0,63.5 3.81,59.69 5.08,59.69 16.51,48.26 5.08,48.26 5.08,26.67 25.4,6.35 29.21,6.35
MISO  (via drill 0.6)
  Top 0.406: SV1.1 85.09,29.21 85.09,31.75 80.01,31.75 77.47,34.29 69.85,34.29 68.58,33.02 68.58,26.67 v67.31,25.4 | U1.16 48.52,34.03 49.53,33.02 50.8,33.02 52.07,31.75 v53.34,31.75
  Bottom 0.406: v67.31,25.4 63.5,25.4 62.23,26.67 62.23,31.75 60.96,33.02 58.42,33.02 57.15,31.75 v53.34,31.75
MOSI
  Top 0.406: PROG.JMP.1 80.01,29.21 81.28,30.48 SV1.4
N$1
  Top 0.254: C7.1 53.7,40.69 53.47,40.69 53.34,40.64
  Top 0.406: U1.20 51.67,38.97 52.7,39.37 52.7,40.64 53.34,40.64
N$2
  Top 0.254: R42.1 24.33,61.21 24.33,63.96 25.25,64.87 R41.2 25.25,65.1 23.98,66.29 23.06,67.21 JP1.8
N$3
  Top 0.254: R44.1 13.41,63.86 13.42,65.45 15.24,65.41 17.58,67.21 JP1.12 17.58,67.44 16.66,68.35 16.66,70.18 14.15,72.69 R43.2
N$4
  Top 0.406: R1.1 46.99,50.16 45.72,48.9 arc53 45.09,46.99 45.09,45.72 45.32,45.48 U1.29
N$5  (1 unrouted)
N$6  (via drill 0.5, 0.5 pad 0.25)
  Top 0.406: C5.1 38.1,44.45 v38.08,45.99 | U1.7 39.67,37.37 38.23,37.02 v36.58,37.34
  Bottom 0.254: 41.81,45.72 41.81,44.35 20MHZ.1
  Bottom 0.406: 41.91,45.72 41.81,45.72 v38.08,45.99 arc90 37.68,45.3 C5.1 arc-90 38.1,44.03 v36.58,37.34
N$7  (via drill 0.61)
  Top 0.254: C6.1 34.27,37.03 34.27,36.8 34.29,36.8 | v39.56,35.37 39.98,36.57 39.98,36.58
  Top 0.406: U1.8 39.98,36.57 38.99,36.57 38.99,36.11 34.29,36.57 34.29,36.8 34.29,36.83
  Bottom 0.254: v39.56,35.37 40.01,35.37 41.81,34.75 20MHZ.2
N$8  (via drill 0.6)
  Top 0.254: C8.1 53.7,35.66 53.47,35.66 53.34,35.56
  Top 0.406: U1.18 51.53,37.37 arc-90 52.07,36.83 | 52.07,36.83 arc90 53.34,35.56 | R5.1 52.49,48.68 v52.07,48.26 | v52.28,34.32 52.07,36.83
  Bottom 0.406: v52.07,48.26 52.07,46.99 49.53,44.45 49.53,35.56 50.8,34.29 v52.28,34.32
N$9
  Top 0.406: U1.22 50.08,40.64 52.07,40.64 52.44,41.9 arc-90 53.34,43.18 R21.2
N$10
  Top 0.406: U1.19 arc90 50.08,38.1 R22.2
N$12  (1 unrouted)
N$13
  Top 0.254: JP1.6 25.58,67.21 29.59,65.1 30.28,65.1 R35.2 30.51,65.1 39.29,64.47 R36.1
N$16
  Top 0.406: U4.8 41.27,18.41 arc90 40.64,17.78 38.1,17.78 R7.1 R8.1
N$17
  Top 0.406: R9.2 45.72,31.75 arc-90 45.32,33.42 U1.12
N$18
  Top 0.406: JP5*.2 R6.2
N$21
  Top 0.406: JP9*.2 R4.2
N$22
  Top 0.254: SW1.3 41.81,64.47 41.81,60.12 SW1.4
  Top 0.406: SW1.4 41.83,54.69 41.91,54.61 46.57,54.61 R1.2
N$23
  Top 0.254: R34.1 33.35,68.58 30.84,66.06 29.23,66.06 28.09,67.21 JP1.4 28.09,67.44 29.28,67.44 29.28,67.68 30.28,68.5 28.95,69.89 30.15,71.09 31.75,71.09 33.35,72.69 34.27,72.69 R17.2
N$25
  Top 0.406: JP8*.2 R18.2
N$27  (1 unrouted)
N$31
  Top 0.254: TP2.TP 93.93,48.23 90.5,48.23 U$1.1
  Top 0.813: C11.2 88.9,52.07 90.17,52.07 U$1.1
N$32
  Top 0.406: JP7*.2 R2.2
N$34  (via drill 0.61)
  Top 0.254: v39.06,21.03 42.95,21.03 U4.6
  Bottom 0.254: v39.06,21.03 30.66,22.33 30.66,27.96 12.65,26.76 8.31,30.12 8.67,44.24 7.07,44.99 11.61,46.3 12.09,44.7
  Bottom 0.305: JP2*.2 11.82,43.89 11.82,44.7 12.09,44.7
N$37
  Top 0.254: U2.1 24.21,31.09 24.21,30.63 24.13,30.48
  Top 0.406: 24.13,30.48 24.55,30.06 R19.1 21.59,22.86 R20.2
N$38  (via drill 0.61)
  Top 0.254: C1.1 29.23,27.66 29.21,27.94 | v27.62,33.12 27.64,32.92 29.01,31.55 U2.3
  Top 0.813: U2.3 arc-90 29.21,30.96 29.21,27.94
  Bottom 0.61: 15.63,38.3 15.63,32.46 27.62,33.02 v27.62,33.12 | 15.6,38.3 15.63,38.3 | 15.63,38.3 U$7.2 12.07,37.96
N$39
  Top 0.406: JP6*.2 R3.2
N$41
  Top 0.813: C10.2 U3.8
N$43
  Top 0.254: R37.2 42.04,72.69 42.04,70.18 R38.1 41.81,69.95 33.12,69.95 JP1.2
N$49
  Top 0.813: R26.2 C11.1 U3.5
N$50
  Bottom 0.813: C12.1 72.39,68.58 R26.1
N$51
  Top 0.254: R46.1 10.9,63.86 10.9,64.77 10.91,65.64 12.55,65.64 12.55,65.65 15.06,67.21 JP1.14 15.06,67.44 15.06,68.35 14.15,69.27 14.15,69.95 13,71.09 8.89,71.09 7.29,72.69 6.37,72.69 R45.2
N$52
  Top 0.254: R48.1 15.77,64.25 18.52,61.09 18.97,60.63 20.22,60.63 21.13,61.54 R47.2 21.36,63.04 20.09,66.98 20.32,67.21 JP1.10
N$53
  Top 0.254: R49.2 2.72,66.29 3.17,66.29 2.54,66.04 2.54,63.86 8.15,63.86 R50.1 8.38,63.86 8.25,63.86 8.25,67.31 JP1.16 | JP1.16 12.55,66.75 12.55,67.21 JP1.16
PB0  (via drill 0.6)
  Top 0.406: TP13.TP JP5*.1 | v56.87,21.4 46.69,31.41 arc90 46.36,32.38 46.12,32.38 U1.13
  Bottom 0.406: JP5*.1 41.91,6.35 43.18,5.08 62.23,5.08 62.23,16.51 v56.87,21.4
PB1  (via drill 0.6)
  Top 0.406: TP14.TP JP6*.1 46.99,7.62 46.99,8.89 59.69,8.89 v60.04,12.77 | v59.69,16.51 v48.26,27.94 | v52.03,29.14 49.53,31.75 48.26,31.75 46.99,33.02 46.99,35.01 U1.14
  Bottom 0.406: v60.04,12.77 v59.69,16.51 | v48.26,27.94 50.8,27.94 v52.03,29.14
PB2  (via drill 0.6)
  Top 0.406: TP17.TP JP7*.1 | PROG.JMP.3 73.66,12.7 76.2,10.16 v76.2,5.08 | v63.5,6.35 v60.96,6.35
  Bottom 0.406: v76.2,5.08 64.77,5.08 v63.5,6.35 | v60.96,6.35 49.53,6.35 JP7*.1
PB3  (via drill 0.5, 0.6)
  Top 0.305: v55.11,11.91 55.19,13.8 v55.16,13.93
  Top 0.406: TP18.TP JP8*.1 | v40.64,24.13 v40.64,26.67 | v40.64,29.21 40.64,35.08 U1.9
  Bottom 0.305: 55.23,8.33 55.24,8.33 v55.11,11.91 | v55.16,13.93 55.24,15.73 55.24,16.51
  Bottom 0.406: JP8*.1 55.23,8.33 | 55.24,16.51 40.64,16.51 v40.64,24.13 | v40.64,26.67 v40.64,29.21
PB3/MOSI  (via drill 0.6)
  Top 0.254: PROG.JMP.2 76.1,31.77 73.81,31.77 PROG.JMP.4
  Top 0.406: PROG.JMP.4 72.39,31.75 71.12,30.48 71.12,26.67 v67.31,22.86 | v58.42,24.13 50.16,32.38 48.9,32.38 47.62,33.66 47.62,34.98 U1.15
  Bottom 0.406: v67.31,22.86 59.69,22.86 v58.42,24.13
PB4  (via drill 0.6)
  Top 0.406: TP19.TP JP9*.1 67.31,7.62 68.58,8.89 68.58,11.43 v49.33,30.31 | v43.66,32.95 43.72,33.12 U1.10
  Bottom 0.406: v49.33,30.31 46.99,33.02 v43.66,32.95
PD7
  Top 0.406: R23.2 43.18,31.75 44.45,31.75 arc90 44.52,31.82 U1.11
RESET  (via drill 0.6)
  Top 0.406: v81.28,11.43 v77.47,11.43 | v72.39,15.24 v69.85,17.78 | v64.77,10.16 v60.96,10.16 | v35.56,11.43 R25.1
  Bottom 0.406: SV1.3 90.17,30.48 88.34,25.57 81.09,25.36 81.33,19.45 v81.28,11.43 | v77.47,11.43 76.2,11.43 v72.39,15.24 | v69.85,17.78 68.58,17.78 67.31,16.51 67.31,12.7 v64.77,10.16 | v60.96,10.16 59.06,10.45 58.87,13.06 44.67,13.16 39.48,11.82 35.56,10.16 v35.56,11.43
SCK  (via drill 0.6)
  Top 0.406: SV1.6 82.55,33.02 80.01,35.56 v67.31,35.56 | v58.42,41.91 58.42,35.56 55.88,33.02 52.07,33.02 50.8,34.29 49.94,35.56 U1.17
  Bottom 0.406: v67.31,35.56 64.77,35.56 v58.42,41.91
SUMS
  Top 0.406: R6.1 R3.1 R2.1 50.8,14.82 | TP1.TP 60.96,13.97 59.69,15.24 57.57,15.24 R4.1 R18.1 50.8,14.82 | U4.1 50.8,18.41 50.8,14.82
V-  (via drill 0.5, 0.6)
  Top 0.254: v39.37,15.73 42.49,15.77 46.38,19.66 48.21,19.66 U4.2 | 13.24,30.98 JP1*.1
  Top 0.406: v22.86,25.4 17.78,30.48 13.79,30.48 JP1*.1
  Bottom 0.406: v22.86,25.4 27.94,20.32 33.02,20.32 33.02,15.77 33.06,15.73 v39.37,15.73

### Text on the board
Name: 9V | GND